# Altium schematic sheet Controller.SchDoc
size A3; DocumentNumber: 5; SheetNumber: 1; SheetTotal: 1
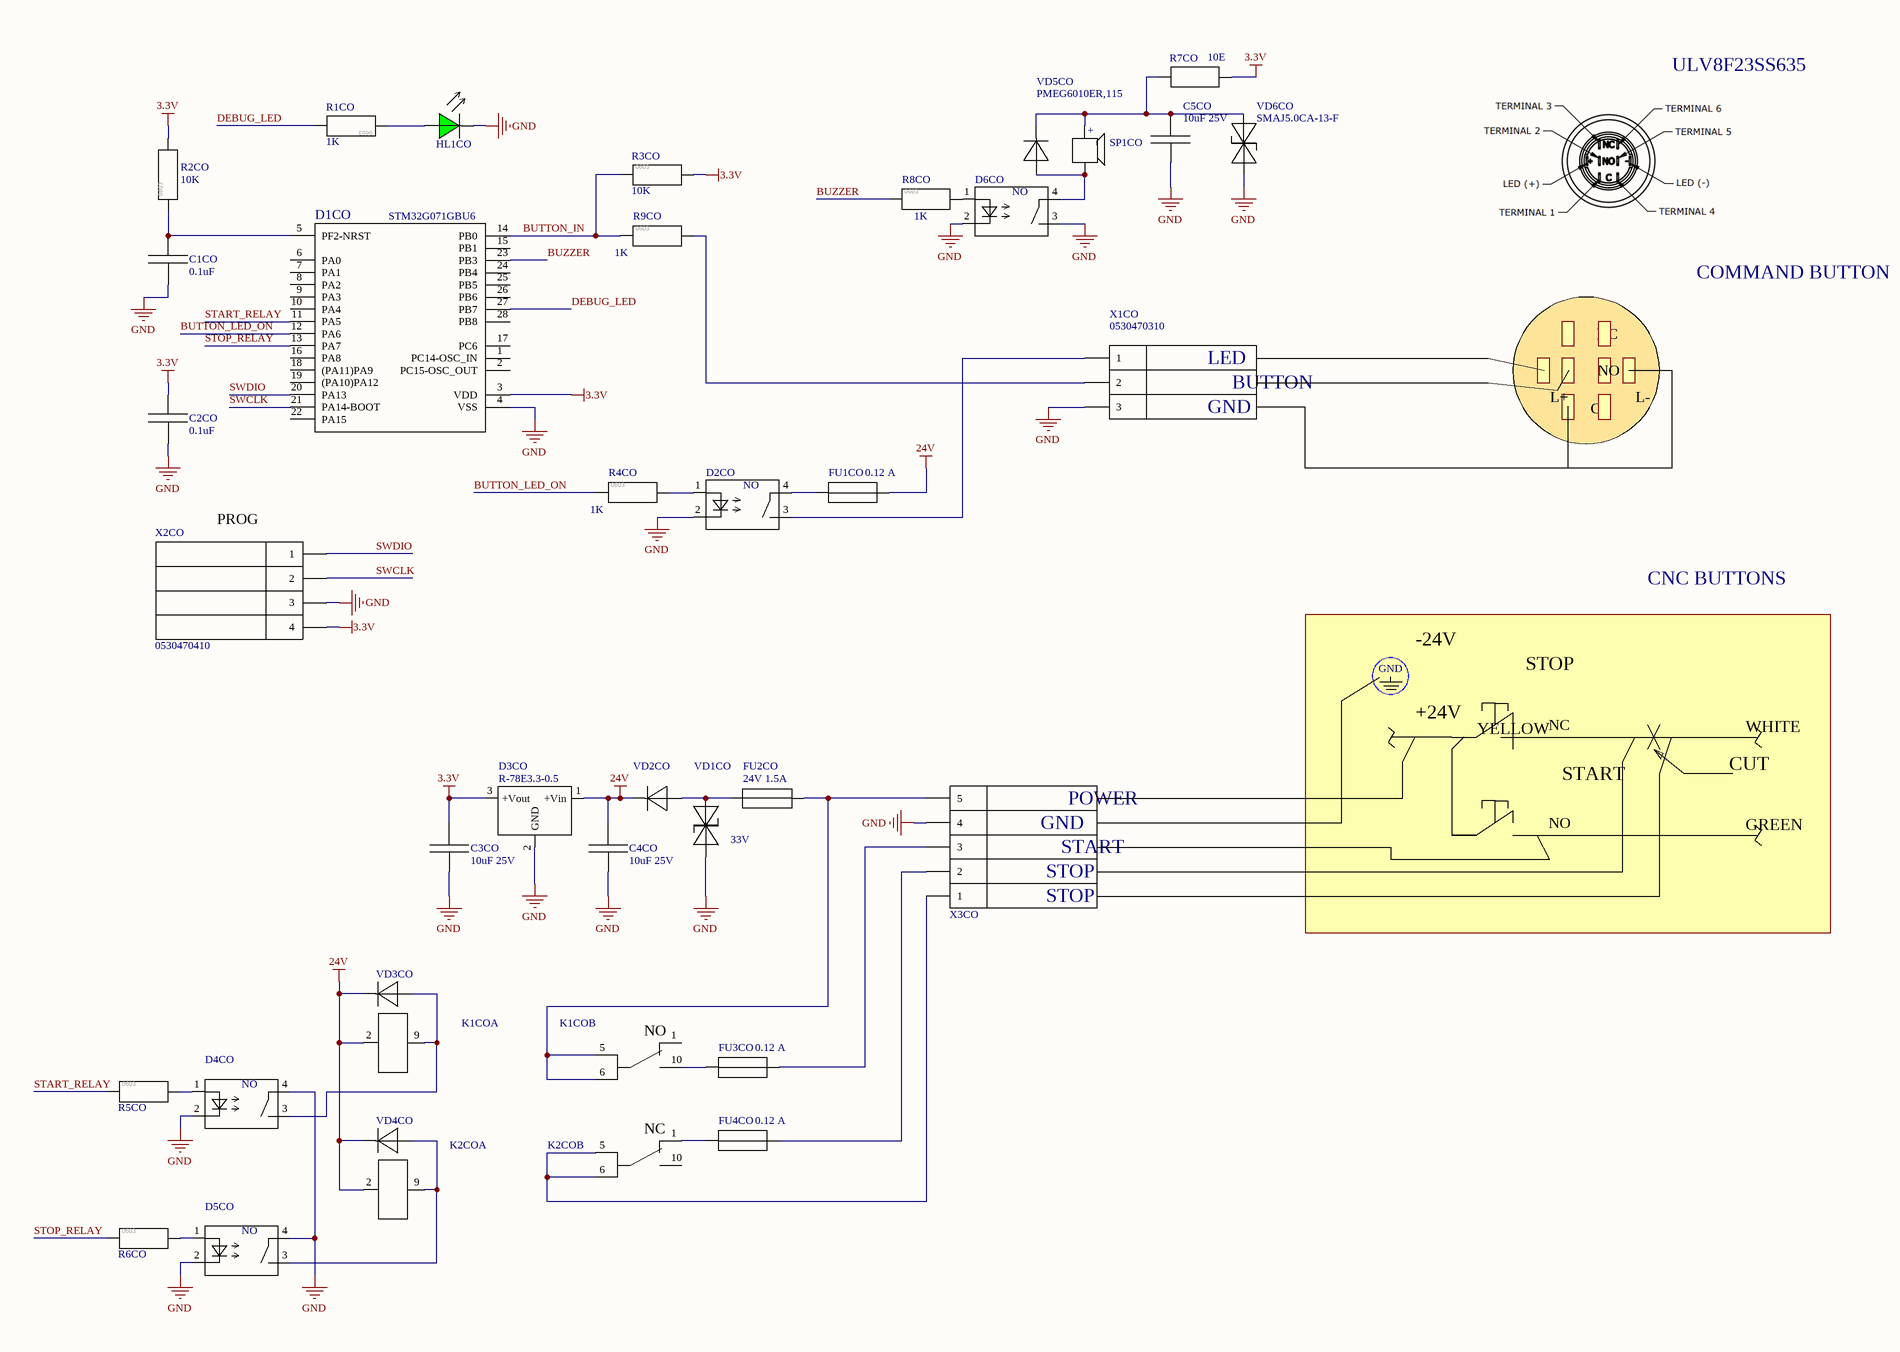
[diagram p0: Controller.SchDoc, left]
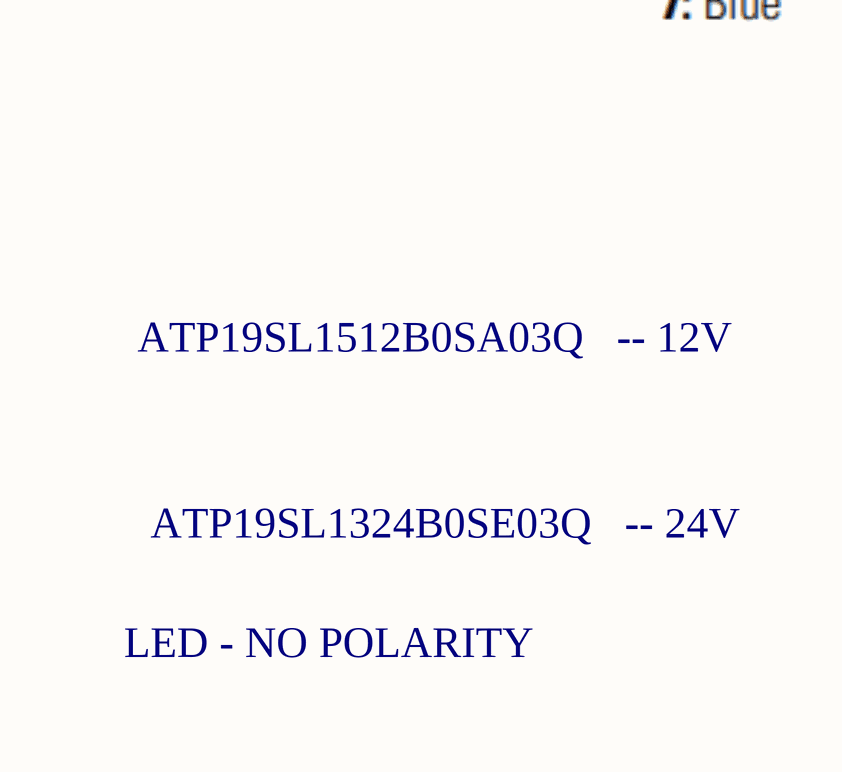
[diagram p1: Controller.SchDoc, right]

## Parts
C1CO  value 0.1uF  [C0603pads]  (hidden comment: CL10B104KB8NNNC)
C2CO  value 0.1uF  [C0603pads]  (hidden comment: CL10B104KB8NNNC)
C3CO  value 10uF 25V  [C1210 LowESR]  (hidden comment: C3225X8R1E106K250AC)
C4CO  value 10uF 25V  [C1210 LowESR]  (hidden comment: C3225X8R1E106K250AC)
C5CO  value 10uF 25V  [C1210 LowESR]  (hidden comment: C3225X8R1E106K250AC)
D1CO  STM32G071GBU6  [UFQFPN28]
D2CO  CPC1014NTR  [SOP-4]  (value not drawn)
D3CO  R-78E3.3-0.5  [R-78XX-0.5]
D4CO  CPC1014NTR  [SOP-4]  (value not drawn)
D5CO  CPC1014NTR  [SOP-4]  (value not drawn)
D6CO  CPC1014NTR  [SOP-4]  (value not drawn)
FU1CO  value 0.12 A  [FUSE 1206]  (hidden comment: 0ZCJ0012FF2E)
FU2CO  value 24V 1.5A  [FUSE 1812]  (hidden comment: 1812L150/24MR)
FU3CO  value 0.12 A  [FUSE 1206]  (hidden comment: 0ZCJ0012FF2E)
FU4CO  value 0.12 A  [FUSE 1206]  (hidden comment: 0ZCJ0012FF2E)
HL1CO  KT-0805G  [LED 0805 GREEN]  (value not drawn)
K1CO  G5V-1-DC24  [G5V-1]  (value not drawn)  (parts A,B of 2)
K2CO  G5V-1-DC24  [G5V-1]  (value not drawn)  (parts A,B of 2)
R1CO  value 1K  [R0603_MIN_pads]  (hidden comment: RC0603FR-071KL)
R2CO  value 10K  [R0603_pads]  (hidden comment: RC0603FR-0710KL)
R3CO  value 10K  [R0603_pads]  (hidden comment: RC0603FR-0710KL)
R4CO  value 1K  [R0603_MIN_pads]  (hidden comment: RC0603FR-071KL)
R5CO  RC0603FR-071KL  [R0603_MIN_pads]  (value not drawn)
R6CO  RC0603FR-071KL  [R0603_MIN_pads]  (value not drawn)
R7CO  value 10E  [R0805]  (hidden comment: RC0805FR-0710RL)
R8CO  value 1K  [R0603_MIN_pads]  (hidden comment: RC0603FR-071KL)
R9CO  value 1K  [R0603_MIN_pads]  (hidden comment: RC0603FR-071KL)
SP1CO  MLT-9650  [buzer_9.6x9.6]  (value not drawn)
VD1CO  value 33V  [SMAJ]  (hidden comment: SMAJ30CA-TR)
VD2CO  PMEG6010ER,115  [SOD123]  (value not drawn)
VD3CO  PMEG6010ER,115  [SOD123]  (value not drawn)
VD4CO  PMEG6010ER,115  [SOD123]  (value not drawn)
VD5CO  PMEG6010ER,115  [SOD123]
VD6CO  SMAJ5.0CA-13-F  [SMAJ]
X1CO  0530470310  [0530470310]
X2CO  0530470410  [0530470410]
X3CO  1984992  [1984992]  (value not drawn)

## Nets
3.3V: C2CO.1 C3CO.2 D1CO.3(VDD) D3CO.3(+Vout) R2CO.2 R3CO.2 R7CO.2 X2CO.4
24V: C4CO.2 D3CO.1(+Vin) FU1CO.2 K1CO.2 K2CO.2 VD2CO.1 VD3CO.1 VD4CO.1
GND: C1CO.2 C2CO.2 C3CO.1 C4CO.1 C5CO.1 D1CO.4(VSS) D2CO.2 D3CO.2(GND) D4CO.2 D4CO.4 D5CO.2 D5CO.4 D6CO.2 D6CO.3 HL1CO.2 VD1CO.1 VD6CO.1 X1CO.3 X2CO.3 X3CO.4
BUTTON_IN: D1CO.14(PB0) R3CO.1 R9CO.1
BUTTON_LED_ON: D1CO.12(PA6) R4CO.1
BUZZER: D1CO.23(PB3) R8CO.1
DEBUG_LED: D1CO.27(PB7) R1CO.2
START_RELAY: D1CO.11(PA5) R5CO.1
STOP_RELAY: D1CO.13(PA7) R6CO.1
SWCLK: D1CO.21(PA14-BOOT) X2CO.2
SWDIO: D1CO.20(PA13) X2CO.1
NetC1CO_1: C1CO.1 D1CO.5(PF2-NRST) R2CO.1
NetC5CO_2: C5CO.2 R7CO.1 SP1CO.1 VD5CO.1 VD6CO.2
NetD2CO_1: D2CO.1 R4CO.2
NetD2CO_3: D2CO.3 X1CO.1
NetD2CO_4: D2CO.4 FU1CO.1
NetD4CO_1: D4CO.1 R5CO.2
NetD4CO_3: D4CO.3 K1CO.9 VD3CO.2
NetD5CO_1: D5CO.1 R6CO.2
NetD5CO_3: D5CO.3 K2CO.9 VD4CO.2
NetD6CO_1: D6CO.1 R8CO.2
NetD6CO_4: D6CO.4 SP1CO.2 VD5CO.2
NetFU2CO_1: FU2CO.1 K1CO.5 K1CO.6 X3CO.5
NetFU2CO_2: FU2CO.2 VD1CO.2 VD2CO.2
NetFU3CO_1: FU3CO.1 K1CO.10
NetFU3CO_2: FU3CO.2 X3CO.3
NetFU4CO_1: FU4CO.1 K2CO.1
NetFU4CO_2: FU4CO.2 X3CO.2
NetHL1CO_1: HL1CO.1 R1CO.1
NetK2CO_5: K2CO.5 K2CO.6 X3CO.1
NetR9CO_2: R9CO.2 X1CO.2

Not connected (* = marked no-connect by the designer): D1CO 1(PC14-OSC_IN) 2(PC15-OSC_OUT) 6(PA0) 7(PA1) 8(PA2) 9(PA3) 10(PA4) 15(PB1) 16(PA8) 17(PC6) 18((PA11)PA9) 19((PA10)PA12) 22(PA15) 24(PB4) 25(PB5) 26(PB6) 28(PB8); K1CO 1; K2CO 10

## Notes on the sheet
- ULV8F23SS635
- COMMAND BUTTON
- NC
- ATP19SL1512B0SA03Q   -- 12V
- GND
- LED
- BUTTON
- L+
- C
- NO
- L-
- PROG
- ATP19SL1324B0SE03Q   -- 24V
- CNC BUTTONS
- -24V
- LED - NO POLARITY
- +24V
- STOP
- YELLOW
- START
- CUT
- WHITE
- POWER
- GREEN
- (near K1CO) NO
- (near K2CO) NC
- (in symbol CPC1014NTR) NO
- (in symbol MLT-9650) +
- (in symbol RC0603FR-071KL) 0603
- (in symbol RC0603FR-0710KL) 0603

## Library data of the parts
C1CO C2CO = CL10B104KB8NNNC: CAP CER 0.1UF 50V X7R 0603 jlc; Manufacturer: Samsung Electro-Mechanics; Operating Temperature: -55°C ~ 85°C; Part Number: CL10B104KB8NNNC; Publisher: *; Supplier 1: Farnell; Supplier 2: Digi-Key; Supplier Part Number 2: 1276-1000-1-ND; Supplier 3: jlcpcb; Supplier Part Number 3: C1591
C3CO C4CO C5CO = C3225X8R1E106K250AC: CAP CER 10UF 25V X8R 1210; Manufacturer: TDK Corporation; Part Number: C3225X8R1E106K250AC; Operating Temperature: -55°C ~ 85°C; Publisher: *; Supplier 1: Mouser; Supplier 2: Digi-Key; Supplier Part Number 2: 445-174832-1-ND; Supplier 3: jlcpcb
D1CO = STM32G071GBU6: IC MCU 32BIT 128KB FLSH 28UFQFPN jlc; Manufacturer: STMicroelectronics; Supplier 1: Farnell; Supplier 2: Digi-Key; Operating Temperature: -40°C ~ 85°C; Supplier Part Number 2: 497-18343-ND; Value: STM32G071GBU6; Part Number: STM32G071GBU6; Supplier 3: jlcpcb; Supplier Part Number 3: C529347
D2CO D4CO D5CO D6CO = CPC1014NTR: SSR RELAY SPST-NO 400MA 0-60V jlc; Manufacturer: Littelfuse Inc.; Value: 60V 0.4A; Operating Temperature: -55°C ~ 110°C; Part Number: CPC1014NTR; Publisher: *; Supplier 1: Farnell; Supplier 2: Digi-Key; Supplier Part Number 2: 5656-CPC1014NTRCT-ND; Supplier Part Number 3: C2760365; Supplier 3: jlcpcb
D3CO = R-78E3.3-0.5: DC DC CONVERTER 3.3V 2W; Manufacturer: Recom Power; Operating Temperature: -40°C ~ 85°C; Supplier 1: Farnell; Supplier 2: Digi-key; Supplier Part Number 2: 945-1661-5-ND; Value: R-78E3.3-0.5; Supplier 3: Mouser; Part Number: R-78E3.3-0.5
FU1CO FU3CO FU4CO = 0ZCJ0012FF2E: PTC RESET FUSE 48V 120MA 1206 jlc; Manufacturer: Bel Fuse Inc.; Part Number: 0ZCJ0012FF2E; Operating Temperature: -40°C ~ 85°C; Publisher: *; Supplier 1: Farnell; Supplier 2: Digi-Key; Supplier Part Number 1: *; Supplier Part Number 2: 507-1795-1-ND; Supplier 3: jlcpcb; Supplier Part Number 3: C3761769
FU2CO = 1812L150/24MR: PTC RESET FUSE 24V 1.5A 1812 jlc; Manufacturer: Littelfuse Inc.; Part Number: 1812L150/24MR; Operating Temperature: -40°C ~ 85°C; Publisher: *; Supplier 1: Farnell; Supplier 2: Digi-Key; Supplier Part Number 2: F3487CT-ND; Supplier 3: jlcpcb; Supplier Part Number 3: C142805
HL1CO = KT-0805G: LED EMERALD GREEN 0805 SMD jlc; Manufacturer: Hubei KENTO Elec; Part Number: KT-0805G; Value: KT-0805G; Operating Temperature: -55°C ~ 85°C; Publisher: *; Supplier 1: Farnell; Supplier 2: Digi-Key; Supplier Part Number 3: C2297; Supplier 3: jlcpcb
K1CO K2CO = G5V-1-DC24: RELAY GEN PURPOSE SPDT 1A 24VDC; Manufacturer: Omron; Value: G5V-1-DC24; Supplier 1: Farnell; Supplier 2: Digi-Key; Supplier 3: Mouser; Supplier 4: TME; Supplier Part Number 1: *; Supplier Part Number 2: Z775-ND; Supplier Part Number 3: 653-G5V-1-DC24; Supplier Part Number 4: *; Operating Temperature: -40°C ~ 70°C; Part Number: G5V-1-DC24; Publisher: *
R1CO R4CO R5CO R6CO R8CO R9CO = RC0603FR-071KL: RES SMD 1K OHM 1% 1/10W 0603 jlc; Manufacturer: Yageo; Operating Temperature: -55°C ~ 155°C; Part Number: RC0603FR-071KL; Publisher: *; Supplier 1: Farnell; Supplier 2: Digi-Key; Supplier Part Number 2: 311-1.00KHRCT-ND; Supplier Part Number 3: C22548; Supplier 3: jlcpcb
  R5CO R6CO: Value: 1K
R2CO R3CO = RC0603FR-0710KL: RES 10K OHM 1% 1/10W 0603 jlc; Manufacturer: Yageo; Operating Temperature: -55°C ~ 155°C; Part Number: RC0603FR-0710KL; Publisher: *; Supplier 1: Farnell; Supplier 2: Digi-Key; Supplier Part Number 2: 311-10.0KHRCT-ND; Supplier Part Number 3: C98220; Supplier 3: jlcpcb
R7CO = RC0805FR-0710RL: RES 10 OHM 1% 1/8W 0805 jlc; Manufacturer: Yageo; Operating Temperature: -55°C ~ 155°C; Part Number: RC0805FR-0710RL; Publisher: *; Supplier 1: Farnell; Supplier 2: Digi-Key; Supplier Part Number 2: 311-10.0CRCT-ND; Supplier Part Number 3: C96347; Supplier 3: jlcpcb
SP1CO = MLT-9650: 85dB Active (Built-in Driver Circuit) Electromagnetic Type 2.7kHz Buzzers ROHS jlc; Manufacturer: Yageo; Operating Temperature: -55°C ~ 125°C; Part Number: MLT-9650; Publisher: *; Supplier 1: Farnell; Supplier 2: Digi-Key; Value: MLT-9650; Supplier 3: jlcpcb; Supplier Part Number 3: C96127
VD1CO = SMAJ30CA-TR: TVS DIODE 30VWM 64.3VC SMA; Manufacturer: STMicroelectronics; Operating Temperature: -55°C ~ 150°C (TJ); Part Number: SMAJ30CA-TR; Publisher: *; Supplier 1: Farnell; Supplier 2: Digi-Key; Supplier Part Number 2: 497-7447-1-ND; Supplier 3: Mouser
VD2CO VD3CO VD4CO VD5CO = PMEG6010ER,115: DIODE SCHOTTKY 60V 1A SOD123W; Manufacturer: Nexperia USA Inc.; Value: 60V 1A; Operating Temperature: -65°C ~ 150°C; Part Number: PMEG6010ER,115; Publisher: *; Supplier 1: Farnell; Supplier 2: Digi-Key; Supplier Part Number 2: 1727-5846-1-ND; Supplier 3: Mouser
VD6CO = SMAJ5.0CA-13-F: TVS DIODE 5VWM 9.2VC SMA jlc; Manufacturer: Diodes Incorporated; Operating Temperature: -55°C ~ 150°C (TJ); Part Number: SMAJ5.0CA-13-F; Publisher: *; Supplier 3: jlcpcb; Supplier 2: Digi-Key; Supplier Part Number 2: SMAJ5.0CA-FDICT-ND; Value: SMAJ5.0CA-13-F; Supplier Part Number 3: C134993; Supplier 1: Mouser
X1CO = 0530470310: CONN HEADER VERT 3POS 1.25MM jlc; Manufacturer: Molex; Operating Temperature: -; Value: 0530470310; Part Number: 0530470310; Publisher: *; Supplier 1: Farnell; Supplier 2: Digi-Key; Supplier Part Number 2: WM1732-ND; Supplier 3: jlcpcb; Supplier Part Number 3: C122442
X2CO = 0530470410: CONN HEADER VERT 4POS 1.25MM; Manufacturer: Molex; Operating Temperature: -; Value: 0530470410; Part Number: 0530470410; Publisher: *; Supplier 1: Farnell; Supplier 2: Digi-Key; Supplier Part Number 2: WM1733-ND; Supplier 3: jlcpcb
X3CO = 1984992: TERM BLOCK 5POS 45DEG 3.5MM PCB; Manufacturer: Phoenix Contact; Operating Temperature: -; Value: 1984992; Part Number: 1984992; Publisher: *; Supplier 1: Farnell; Supplier 2: Digi-Key; Supplier Part Number 2: 277-7675-ND; Supplier 3: Mouser